# EAGLE schematic Schematic (EAGLE 9.6.2)
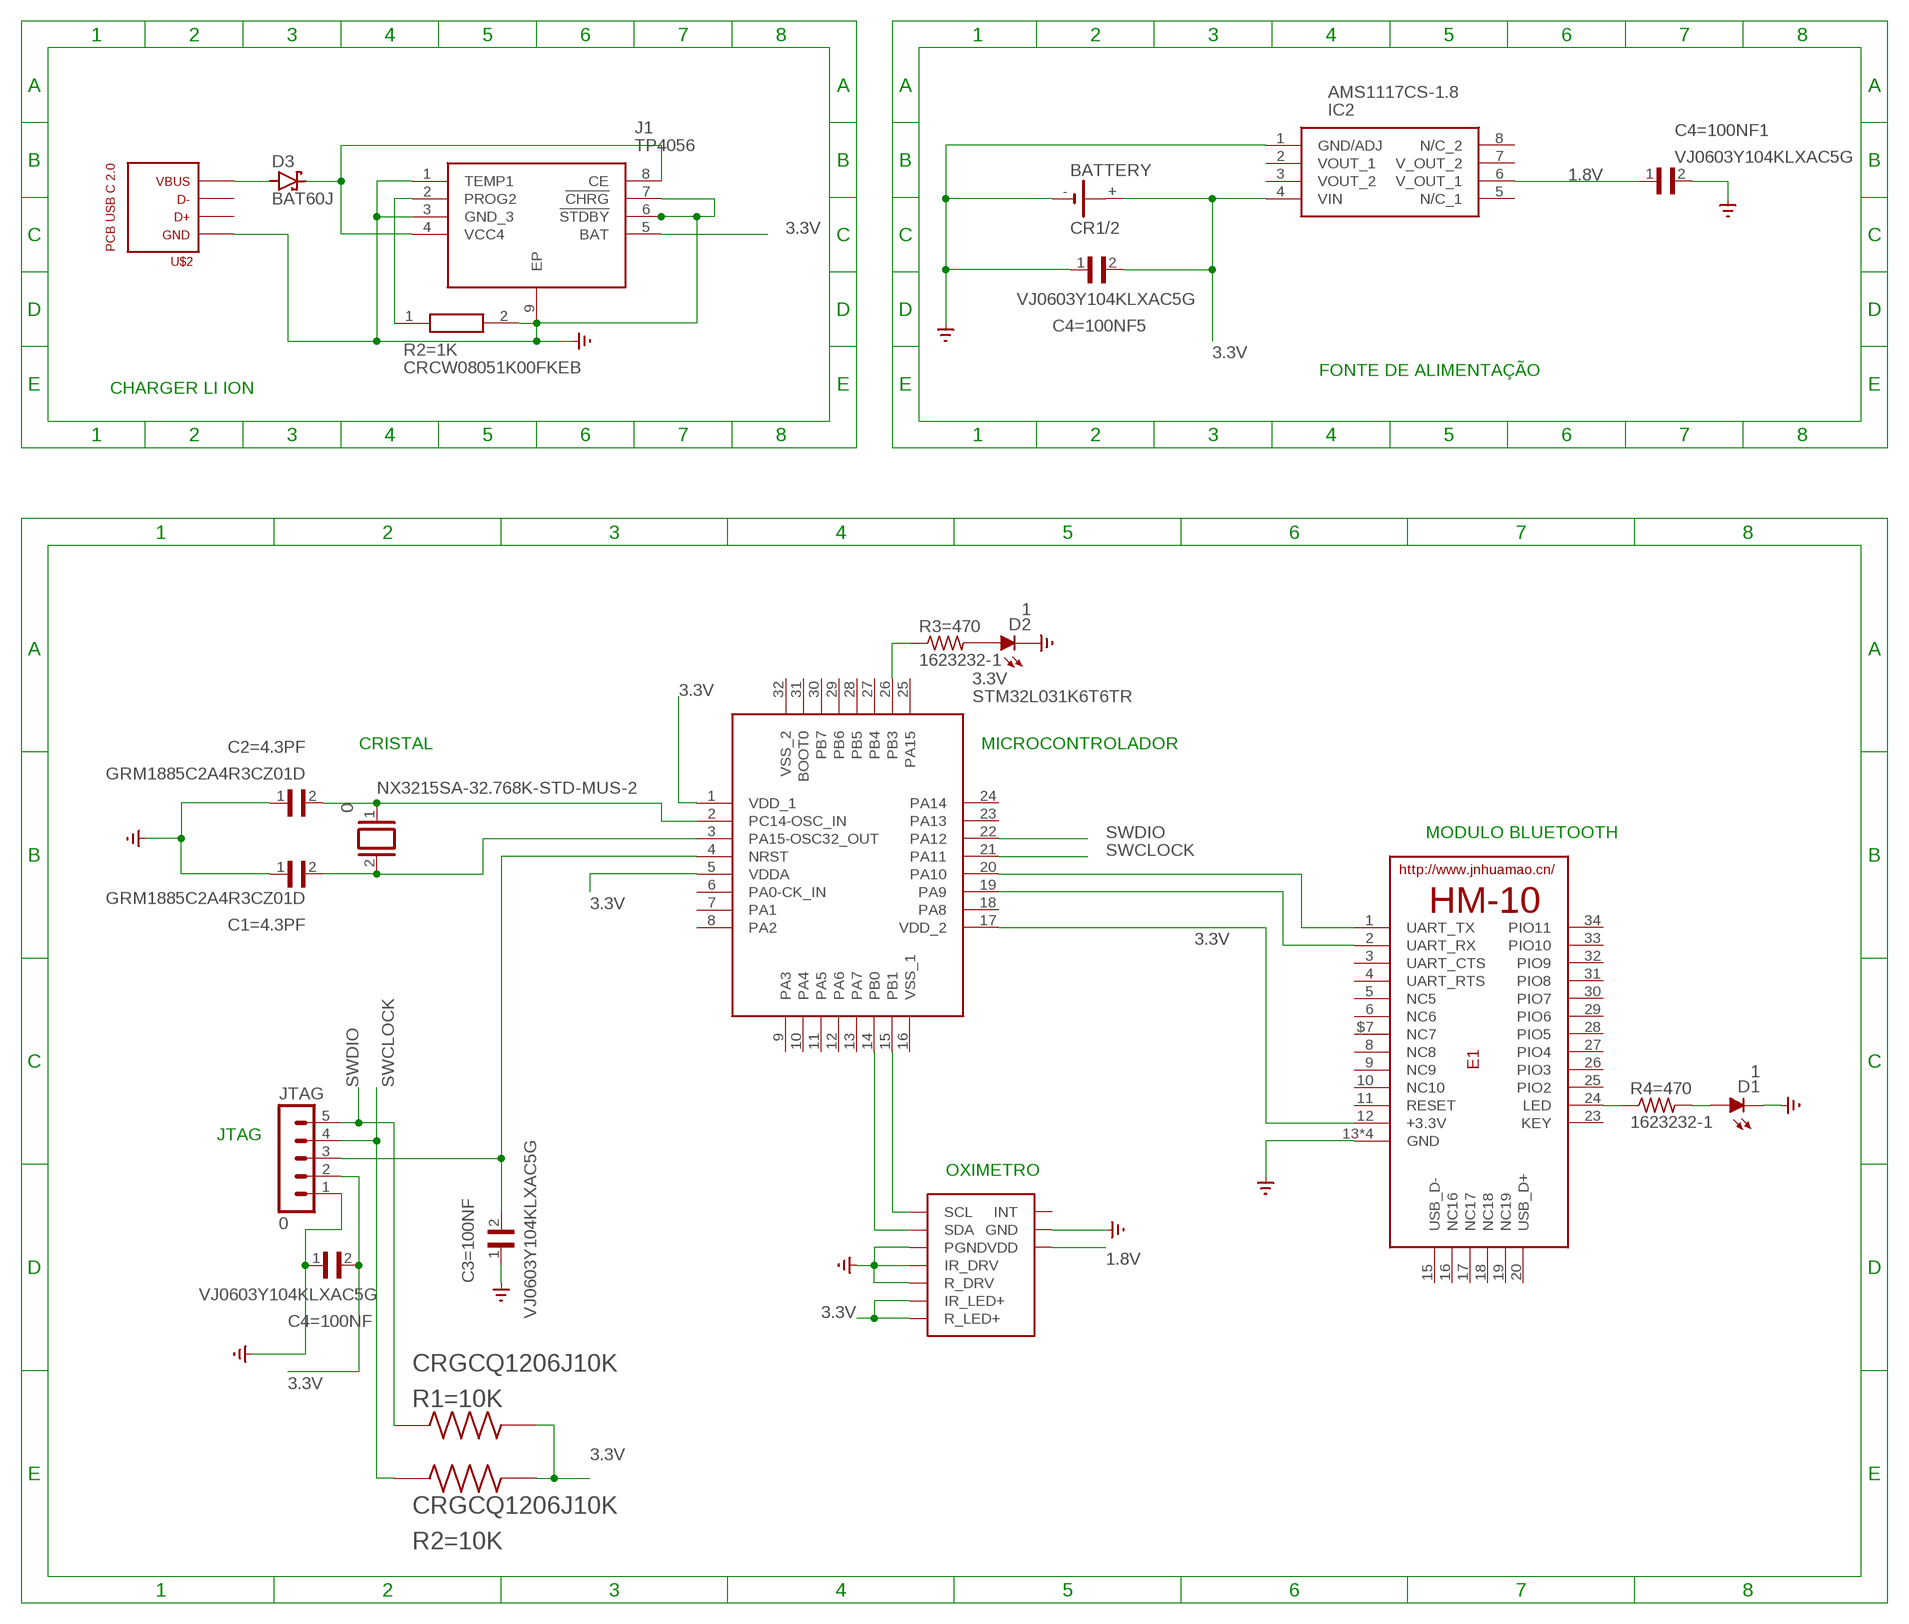
[diagram p0: schematic, sheet 1]

## Parts
3.3V  STM32L031K6T6TR  [QFP80P900X900X160-32N]
BATTERY  CR1/2  [CR1/2]
C1=4.3PF  GRM1885C2A4R3CZ01D  [CAPC1608X90N]
C2=4.3PF  GRM1885C2A4R3CZ01D  [CAPC1608X90N]
C3=100NF  VJ0603Y104KLXAC5G  [CAPC1608X92N]
C4=100NF  VJ0603Y104KLXAC5G  [CAPC1608X92N]
C4=100NF1  VJ0603Y104KLXAC5G  [CAPC1608X92N]
C4=100NF5  VJ0603Y104KLXAC5G  [CAPC1608X92N]
D1  1  LED_LEDCHIP-LED0603MP  [LED_CHIP-LED0603MP]
D2  1  LED_LEDCHIP-LED0603MP  [LED_CHIP-LED0603MP]
D3  BAT60J  [SOD323_ST]
E1  HM-10-BOARD  [26.9X13X2.2_BOARD]
IC2  AMS1117CS-1.8  [SOIC127P599X175-8N]
J1  TP4056  [SOIC127P600X175-9N]
JTAG  0  MA05-1  [MA05-1]
NX3215SA-32.768K-STD-MUS-2  0  XTAL  [Q]
R1=10K  CRGCQ1206J10K  [RESC3115X65N]
R2=1K  CRCW08051K00FKEB  [RESC2012X50N]
R2=10K  CRGCQ1206J10K  [RESC3115X65N]
R3=470  1623232-1  [RESC2012X65N]
R4=470  1623232-1  [RESC2012X65N]
U$1  MAX30100  [MAX30100]
U$2  PCB_USB_C_2.0W_5  [USB_TYPE_C_W_2.0_5]

## Nets
1.8V: C4=100NF1.1 IC2.6(V_OUT_1) U$1.11(VDD)
3.3V: 3.3V.1(VDD_1) 3.3V.5(VDDA) 3.3V.17(VDD_2) BATTERY.+ C4=100NF5.2 C4=100NF.2 E1.12(+3.3V) IC2.4(VIN) J1.5(BAT) JTAG.2 R1=10K.2 R2=10K.2 U$1.9(R_LED+) U$1.10(IR_LED+)
GND: BATTERY.- C1=4.3PF.1 C2=4.3PF.1 C3=100NF.1 C4=100NF1.2 C4=100NF5.1 C4=100NF.1 D1.C D2.C E1.13(GND) E1.14(GND) E1.21(GND) E1.22(GND) IC2.1(GND/ADJ) J1.1(TEMP1) J1.3(GND_3) J1.6(!STDBY) J1.7(!CHRG) J1.9(EP) JTAG.1 R2=1K.2 U$1.4(PGND) U$1.5(IR_DRV) U$1.6(R_DRV) U$1.12(GND) U$2.VBUS ; supply symbol labelled SUPPLY0_GND_
N$1: 3.3V.2(PC14-OSC_IN) C2=4.3PF.2 NX3215SA-32.768K-STD-MUS-2.1
N$2: 3.3V.3(PA15-OSC32_OUT) C1=4.3PF.2 NX3215SA-32.768K-STD-MUS-2.2
N$3: 3.3V.15(PB1) U$1.2(SCL)
N$4: 3.3V.14(PB0) U$1.3(SDA)
N$5: 3.3V.20(PA10) E1.1(UART_TX)
N$6: 3.3V.19(PA9) E1.2(UART_RX)
N$7: 3.3V.26(PB3) R3=470.1
N$8: E1.24(LED) R4=470.1
N$9: D1.A R4=470.2
N$10: D3.A U$2.GND
N$11: D2.A R3=470.2
N$12: D3.C J1.4(VCC4) J1.8(CE)
N$14: J1.2(PROG2) R2=1K.1
RESET: 3.3V.4(NRST) C3=100NF.2 JTAG.3
SWCLOCK: 3.3V.21(PA11) JTAG.4 R2=10K.1
SWDIO: 3.3V.22(PA12) JTAG.5 R1=10K.1
Unconnected: 3.3V.6(PA0-CK_IN) 3.3V.7(PA1) 3.3V.8(PA2) 3.3V.9(PA3) 3.3V.10(PA4) 3.3V.11(PA5) 3.3V.12(PA6) 3.3V.13(PA7) 3.3V.16(VSS_1) 3.3V.18(PA8) 3.3V.23(PA13) 3.3V.24(PA14) 3.3V.25(PA15) 3.3V.27(PB4) 3.3V.28(PB5) 3.3V.29(PB6) 3.3V.30(PB7) 3.3V.31(BOOT0) 3.3V.32(VSS_2) BATTERY.+@1(+) E1.3(UART_CTS) E1.4(UART_RTS) E1.5(NC5) E1.6(NC6) E1.8(NC8) E1.9(NC9) E1.10(NC10) E1.11(RESET) E1.15(USB_D-) E1.16(NC16) E1.17(NC17) E1.18(NC18) E1.19(NC19) E1.20(USB_D+) E1.23(KEY) E1.25(PIO2) E1.26(PIO3) E1.27(PIO4) E1.28(PIO5) E1.29(PIO6) E1.30(PIO7) E1.31(PIO8) E1.32(PIO9) E1.33(PIO10) E1.34(PIO11) E1.$7(NC7) IC2.2(VOUT_1) IC2.3(VOUT_2) IC2.5(N/C_1) IC2.7(V_OUT_2) IC2.8(N/C_2) U$1.13(INT) U$2.D+ U$2.D-

## Notes on the sheet
- FONTE DE ALIMENTAÇÃO
- CHARGER LI ION
- CRISTAL | MICROCONTROLADOR
- MODULO BLUETOOTH
- JTAG
- OXIMETRO

## Library data of the parts
3.3V = STM32L031K6T6TR:STM32L031K6T6TR: STMICROELECTRONICS - STM32L031K6T6TR - ARM MCU, STM32 Family STM32L0 Series Microcontrollers, ARM Cortex-M0+, 32bit, 32 MHz, 32 KB, 8 KB Source: Datasheet <https://4donline.ihs.com/images/VipMasterIC/IC/SGST/SGST-S-A0002219924/SGST-S-A0002219924-1.pdf?hkey=6D3A4C79FDBF58556ACFDE234799DDF0>; ARROW_PART_NUMBER: STM32L031K6T6TR; ARROW_PRICE-STOCK: https://www.arrow.com/en/products/stm32l031k6t6tr/stmicroelectronics; DESCRIPTION: STMICROELECTRONICS - STM32L031K6T6TR - ARM MCU, STM32 Family STM32L0 Series Microcontrollers, ARM Cortex-M0+, 32bit, 32 MHz, 32 KB, 8 KB; HEIGHT: 1.6mm; MANUFACTURER_NAME: STMicroelectronics; MANUFACTURER_PART_NUMBER: STM32L031K6T6TR; MOUSER_PART_NUMBER: 511-STM32L031K6T6TR; MOUSER_PRICE-STOCK: https://www.mouser.co.uk/ProductDetail/STMicroelectronics/STM32L031K6T6TR/?qs=xwQlLnDx56Cmxri8cgW0QQ%3D%3D
BATTERY = battery:CR1/2: LI BATTERY Sonnenschein SL-350 PT
C1=4.3PF C2=4.3PF = GRM1885C2A4R3CZ01D:GRM1885C2A4R3CZ01D: Check prices <https://pricing.snapeda.com/parts/GRM1885C2A4R3CZ01D/Murata/view-part?ref=eda>; AVAILABILITY: Bad; DESCRIPTION: 4.3pF ±0.25pF 100V Ceramic Capacitor C0G, NP0 0603 (1608 Metric); MF: Murata; MP: GRM1885C2A4R3CZ01D; PACKAGE: 1608 Murata; PRICE: None
C3=100NF C4=100NF C4=100NF1 C4=100NF5 = VJ0603Y104KLXAC5G:VJ0603Y104KLXAC5G: Multilayer Ceramic Capacitors MLCC - SMD/SMT 100nF 25volts 10% Check prices <https://pricing.snapeda.com/parts/VJ0603Y104KLXAC5G/Vishay/view-part?ref=eda>; AVAILABILITY: Warning; DESCRIPTION: Multilayer Ceramic Capacitors MLCC - SMD/SMT 100nF 25volts 10%; MF: Vishay; MP: VJ0603Y104KLXAC5G; PACKAGE: 0603 Vishay; PRICE: None; PURCHASE-URL: https://pricing.snapeda.com/search/part/VJ0603Y104KLXAC5G/?ref=eda
D1 D2 = 52101-101-REV-A_v16:LED_LED: LED Various Types
D3 = diode:BAT60J: Schottky barrier diode Source: www.st.com, BAT60J.pdf
E1 = JNHuaMao:HM-10: HM Bluetooth module use TI CC2540 or CC2541, Master and slave roles in one, transmission version and remote control version and PIO state acquisition functions in one, Support the AT command modify module parameters, Convenient and flexible.
IC2 = AMS1117CS-1.8:AMS1117CS-1.8: 1A LOW DROPOUT VOLTAGE REGULATOR Source: Datasheet <https://datasheet.datasheetarchive.com/originals/distributors/Datasheets-28/DSA-550594.pdf>; DESCRIPTION: 1A LOW DROPOUT VOLTAGE REGULATOR; HEIGHT: 1.752mm; MANUFACTURER_NAME: Advanced Monolithic Systems; MANUFACTURER_PART_NUMBER: AMS1117CS-1.8
J1 = TP4056:TP4056: 1A Standalone Linear Li-lon Battery Charger, SOP-8 Source: Datasheet <https://dlnmh9ip6v2uc.cloudfront.net/datasheets/Prototyping/TP4056.pdf>; DESCRIPTION: 1A Standalone Linear Li-lon Battery Charger, SOP-8; HEIGHT: 1.75mm; MANUFACTURER_NAME: NanJing Top Power; MANUFACTURER_PART_NUMBER: TP4056
JTAG = con-lstb:MA05-1: PIN HEADER; OC_FARNELL: unknown; OC_NEWARK: unknown
NX3215SA-32.768K-STD-MUS-2 = special:XTAL: CRYSTAL
R1=10K R2=10K = CRGCQ1206J10K:CRGCQ1206J10K: Fixed Resistor CRGCQ 1206 10K 5% Check prices <https://pricing.snapeda.com/parts/CRGCQ1206J10K/TE%20Connectivity/view-part?ref=eda>; AVAILABILITY: Warning; COMMENT: 2-2176344-5; DESCRIPTION: Fixed Resistor CRGCQ 1206 10K 5%; MF: TE Connectivity; MP: CRGCQ1206J10K; PACKAGE: 3115 TE Connectivity; PRICE: None; PURCHASE-URL: https://pricing.snapeda.com/search/part/CRGCQ1206J10K/?ref=eda
R2=1K = CRCW08051K00FKEB:CRCW08051K00FKEB: VISHAY - CRCW08051K00FKEB - RES, THICK FILM, 1K, 1%, 0.125W, 0805, REEL Source: Datasheet <http://www.vishay.com/docs/20035/dcrcwe3.pdf>; ARROW_PART_NUMBER: CRCW08051K00FKEB; ARROW_PRICE-STOCK: https://www.arrow.com/en/products/crcw08051k00fkeb/vishay; DESCRIPTION: VISHAY - CRCW08051K00FKEB - RES, THICK FILM, 1K, 1%, 0.125W, 0805, REEL; HEIGHT: 0.5mm; MANUFACTURER_NAME: Vishay; MANUFACTURER_PART_NUMBER: CRCW08051K00FKEB; MOUSER_PART_NUMBER: 71-CRCW08051K00FKEB; MOUSER_PRICE-STOCK: https://www.mouser.co.uk/ProductDetail/Vishay-Dale/CRCW08051K00FKEB/?qs=DZvKvnD5UYWgZ7Jd5X5uKQ%3D%3D
R3=470 R4=470 = 1623232-1:1623232-1: CRG0805 1% 470R Check prices <https://pricing.snapeda.com/parts/1623232-1/TE%20Connectivity/view-part?ref=eda>; AVAILABILITY: Warning; COMMENT: 1623232-1; DESCRIPTION: 470 Ohms ±1% 0.125W, 1/8W Chip Resistor 0805 (2012 Metric) Thick Film; EU_ROHS_COMPLIANCE: Compliant with Exemptions; MF: TE Connectivity; MP: 1623232-1; PACKAGE: 0805; POWER_RATING: .125 W; PRICE: None; RESISTANCE: 470; TOLERANCE: 1%; VOLTAGE_RATING: 150 V
U$1 = MAX30100:MAX30100
U$2 = USB_pcb_connectors:PCB_USB_C_2.0